# Altium schematic sheet Zero-Cross_Detection.SchDoc
size A4; SheetNumber: 6; SheetTotal: 7
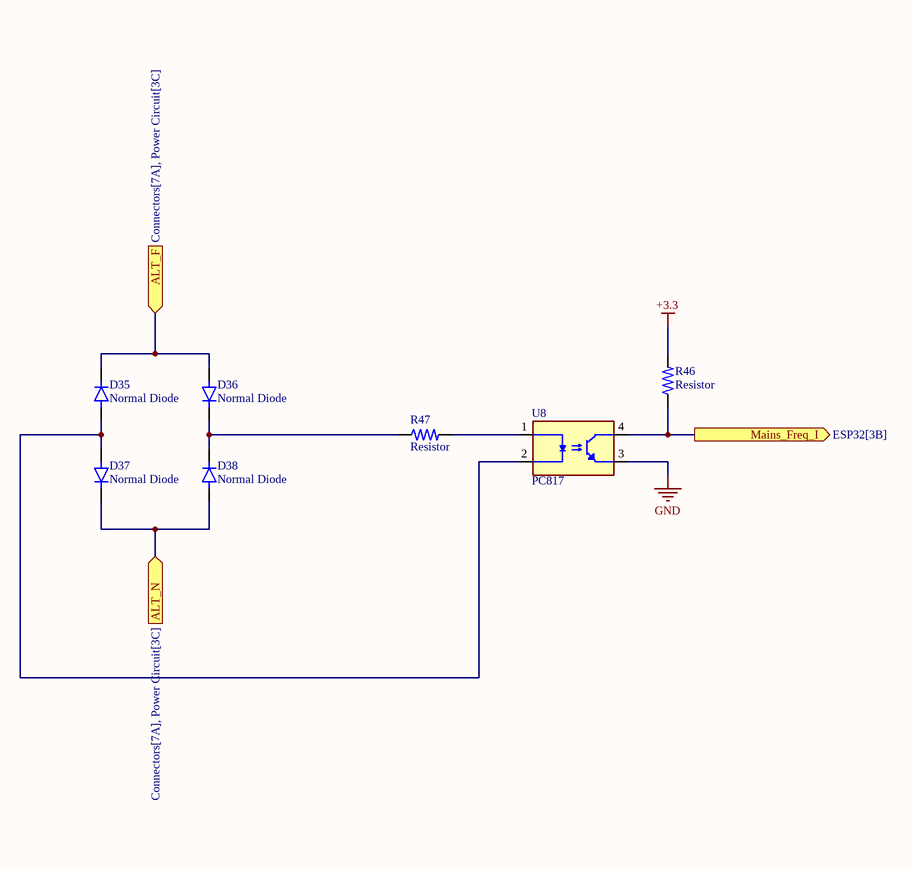
[diagram p0: Zero-Cross_Detection.SchDoc]

## Parts
D35  Normal Diode  [Common Trhough Hole]
D36  Normal Diode  [Common Trhough Hole]
D37  Normal Diode  [Common Trhough Hole]
D38  Normal Diode  [Common Trhough Hole]
R46  Resistor  [Resistor_Through Hole]
R47  Resistor  [Resistor_Through Hole]
U8  PC817  [PC817]

## Ports
ALT_F (in, see Connectors[7A], Power Circuit[3C]), ALT_N (in, see Connectors[7A], Power Circuit[3C]), Mains_Freq_I (out, see ESP32[3B])

## Nets
+3.3: R46.2
GND: U8.3(EMITTER)
ALT_F: D35.1(K) D36.2(A) ; port ALT_F
ALT_N: D37.1(K) D38.2(A) ; port ALT_N
Mains_Freq_I: R46.1 U8.4(COLLECTOR) ; port Mains_Freq_I
NetD35_2: D35.2(A) D37.2(A) U8.2(CATHODE)
NetD36_1: D36.1(K) D38.1(K) R47.1
NetR47_2: R47.2 U8.1(ANODE)

## Library data of the parts
D35-D38 = Normal Diode: MF: NTE Electronics, Inc.; MP: 1N4007; Package: DO-41 NTE Electronics; Check_prices: https://www.snapeda.com/parts/1N4007/NTE+Electronics/view-part/?ref=eda; Value: *; Purchase-URL: https://pricing.snapeda.com/search/part/1N4007/?ref=eda; Availability: In Stock; SnapEDA_Link: https://www.snapeda.com/parts/1N4007/NTE+Electronics/view-part/?ref=snap; Price: None
R46 R47 = Resistor: Power_Rating: .25 W; MP: 2-2176053-0; Tolerance: 1%; Resistance: .33; MF: TE Connectivity; Price: None; Availability: In Stock; EU_RoHS_Compliance: Compliant with Exemptions; Package: 0805; Value: *; SnapEDA_Link: https://www.snapeda.com/parts/2-2176053-0/TE+Connectivity/view-part/?ref=snap; Check_prices: https://www.snapeda.com/parts/2-2176053-0/TE+Connectivity/view-part/?ref=eda
U8 = PC817: Optoisolator Transistor Output - 1 Channel 4-DIP; MP: PC817X3NSZ1B; MF: Sharp Microelectronics; SnapEDA_Link: https://www.snapeda.com/parts/PC817X3NSZ1B/Sharp+Microelectronics/view-part/?ref=snap; Price: None; Purchase-URL: https://pricing.snapeda.com/search/part/PC817X3NSZ1B/?ref=eda; Check_prices: https://www.snapeda.com/parts/PC817X3NSZ1B/Sharp+Microelectronics/view-part/?ref=eda; Value: *; Availability: In Stock; Package: DIP-4 Sharp Microelectronics